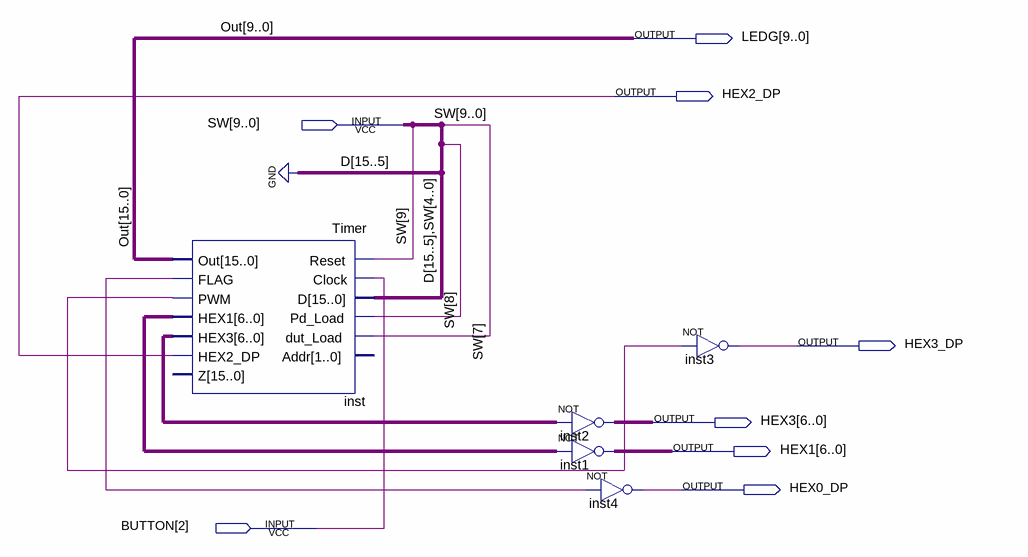
[diagram p0: schematic sheet]
// Quartus schematic TimerTest.bdf as structural Verilog: 5 symbols, 8 pins
module TimerTest (
  input  [9:0] SW,
  input  [2:2] BUTTON,
  output [9:0] LEDG,
  output HEX2_DP,
  output HEX3_DP,
  output [6:0] HEX3,
  output [6:0] HEX1,
  output HEX0_DP
);

  wire inst_flag, inst_pwm;
  wire [6:0] inst_hex1, inst_hex3;
  wire [15:10] Out;

  Timer inst (
    .Reset(SW[9]), .Clock(BUTTON[2]), .D({{11{1'b0}}, SW[4:0]}), .Pd_Load(SW[8]), .dut_Load(SW[7]),
    .Out({Out, LEDG}), .FLAG(inst_flag), .PWM(inst_pwm), .HEX1(inst_hex1), .HEX3(inst_hex3), .HEX2_DP(HEX2_DP));  // open: Addr, Z
  assign HEX3 = ~inst_hex3;  // NOT inst2, 7 bits wide
  assign HEX1 = ~inst_hex1;  // NOT inst1, 7 bits wide
  not inst4 (HEX0_DP, inst_flag);
  not inst3 (HEX3_DP, inst_pwm);

  // Other names for the same wires on the sheet: Out[9:0] = LEDG
endmodule
